# EasyEDA Pro project Core board.eprj

# Schematic Schematic1
Board Name: Board1; Create Date: 2024-09-08; Page Name: P1; Project Name: TestProject (STM32); Schematic Name: Schematic1; Update Date: 2024-12-12; Company: 嘉立创EDA; Page Size: A4; Version: V1.0
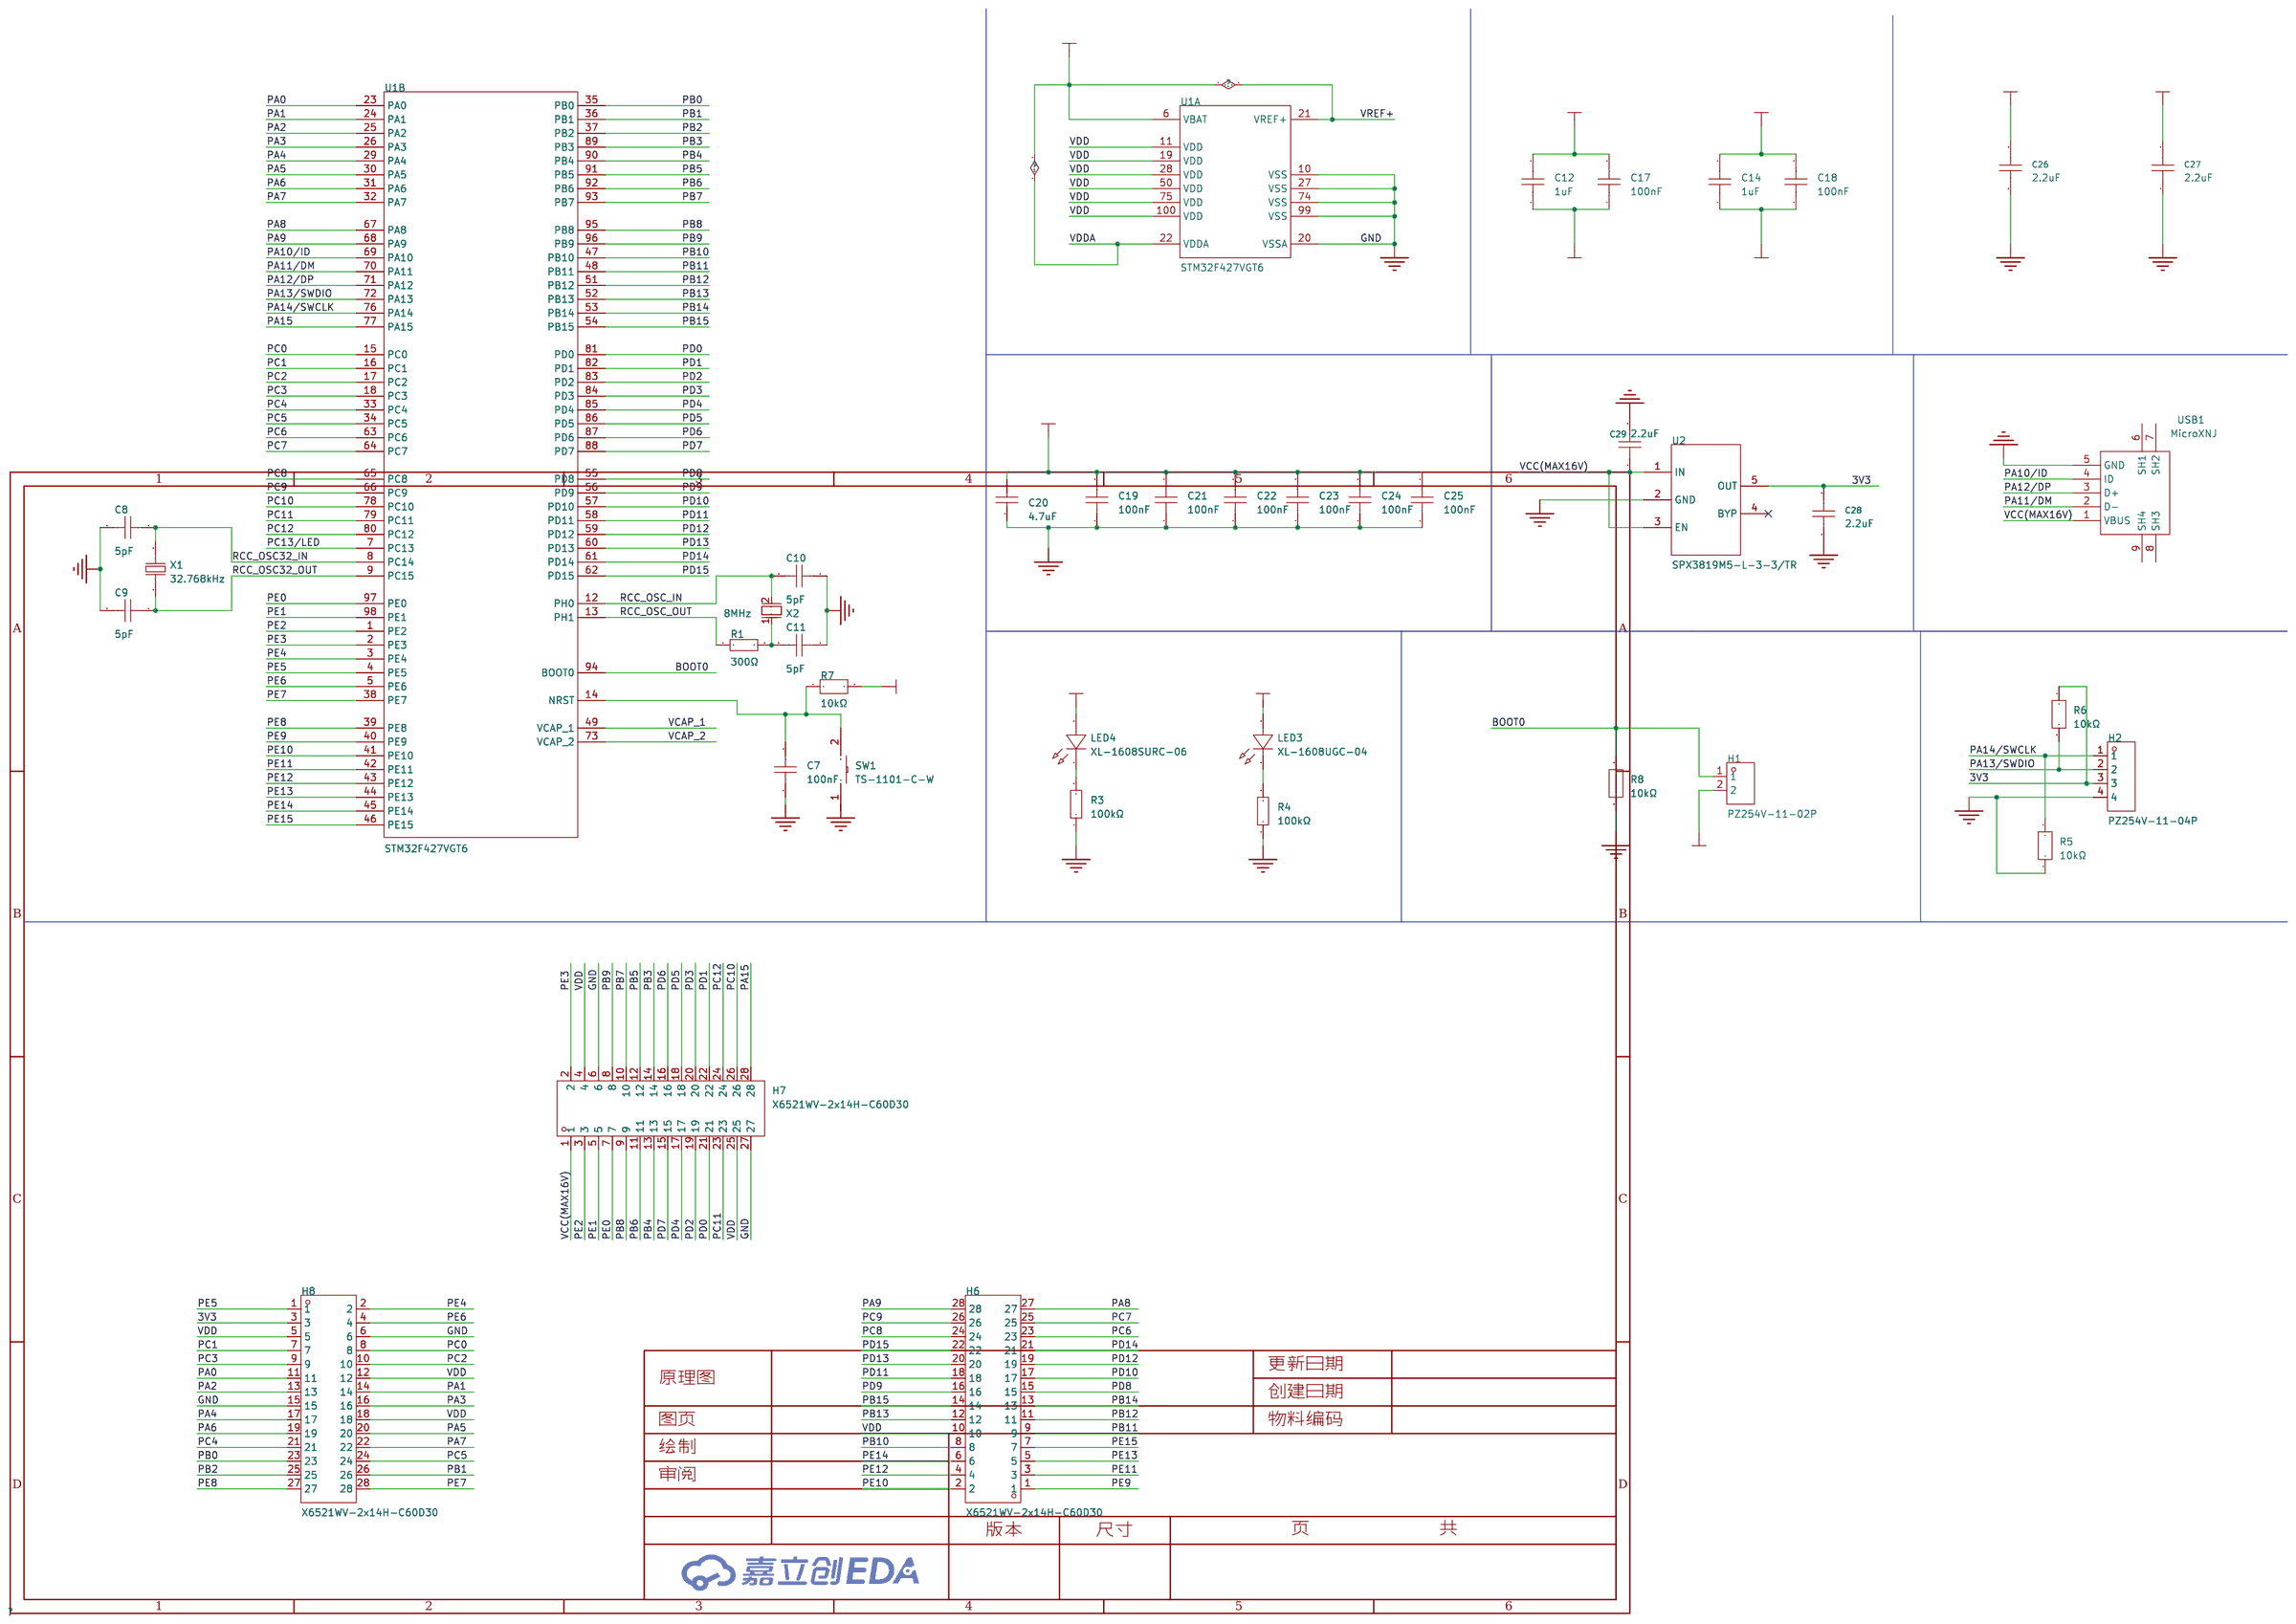
[diagram p0: schematic sheet]

## Parts
C7  100nF  [C0603]
C8  5pF  [C0603]
C9  5pF  [C0603]
C10  5pF  [C0603]
C11  5pF  [C0603]
C12  1uF  [C0603]
C14  1uF  [C0603]
C17  100nF  [C0603]
C18  100nF  [C0603]
C19  100nF  [C0603]
C20  4.7uF  [C0603]
C21  100nF  [C0603]
C22  100nF  [C0603]
C23  100nF  [C0603]
C24  100nF  [C0603]
C25  100nF  [C0603]
C26  2.2uF  [C0603]
C27  2.2uF  [C0603]
C28  2.2uF  [C0603]
C29  2.2uF  [C0603]
H1  PZ254V-11-02P  [HDR-TH_2P-P2.54-V-M]
H2  PZ254V-11-04P  [HDR-TH_4P-P2.54-V-M]
H6  X6521WV-2x14H-C60D30  [HDR-TH_28P-2.54-V-M-R2-C14-S2.54]
H7  X6521WV-2x14H-C60D30  [HDR-TH_28P-2.54-V-M-R2-C14-S2.54]
H8  X6521WV-2x14H-C60D30  [HDR-TH_28P-2.54-V-M-R2-C14-S2.54]
LED3  XL-1608UGC-04  [LED0603-RD_GREEN]
LED4  XL-1608SURC-06  [LED0603-RD_RED]
R1  300Ω  [R0603]
R3  100kΩ  [R0603]
R4  100kΩ  [R0603]
R5  10kΩ  [R0603]
R6  10kΩ  [R0603]
R7  10kΩ  [R0603]
R8  10kΩ  [R0603]
SW1  TS-1101-C-W  [SW-SMD_L6.0-W3.3-LS8.0]
U1  STM32F427VGT6  [LQFP-100_L14.0-W14.0-P0.50-LS16.0-BL]  (sections 1,2)
U2  SPX3819M5-L-3-3/TR  [SOT-23-5_L3.0-W1.7-P0.95-LS2.8-BL]
USB1  MicroXNJ  [MICRO-USB-SMD_MICROXNJ]
X1  32.768kHz  [FC-135R_L3.2-W1.5]
X2  8MHz  [OSC-SMD_2P-L3.2-W2.5]

## Library data of the parts
C7 C17-C19 C21-C25 = CGA0603X7R104K500JT: LCSC Part Name: 100nF ±10% 50V; Supplier Part: C6119867; Manufacturer: HRE(芯声); Supplier Footprint: 0603; Supplier: LCSC; Tolerance: ±10%; Voltage Rated: 50V; Temperature Coefficient: X7R
C8-C11 = CC0603CRNPO9BN5R0: LCSC Part Name: 5pF 50V; Supplier Part: C327203; Manufacturer: YAGEO(国巨); Supplier Footprint: 0603; Datasheet: https://atta.szlcsc.com/upload/public/pdf/source/20181031/C327203_3266E755B61C9DAA88589806E293F44D.pdf; Supplier: LCSC; Voltage Rated: 50V; Temperature Coefficient: NP0
C12 C14 = CL10A105KB8NNNC: LCSC Part Name: 1uF ±10% 50V; Supplier Part: C15849; Manufacturer: SAMSUNG(三星); Supplier Footprint: 0603; Datasheet: https://atta.szlcsc.com/upload/public/pdf/source/20160218/1457707763339.pdf; Supplier: LCSC; Tolerance: ±10%; Voltage Rated: 50V; Temperature Coefficient: X5R
C20 = CL10A475KO8NNNC: LCSC Part Name: 4.7uF ±10% 16V; Supplier Part: C19666; Manufacturer: SAMSUNG(三星); Supplier Footprint: 0603; Datasheet: https://atta.szlcsc.com/upload/public/pdf/source/20160218/1457707763339.pdf; Supplier: LCSC; Tolerance: ±10%; Voltage Rated: 16V; Temperature Coefficient: X5R
C26-C29 = CL10A225KB8NNNC: LCSC Part Name: 2.2uF ±10% 50V; Supplier Part: C913904; Manufacturer: SAMSUNG(三星); Supplier Footprint: 0603; Datasheet: https://atta.szlcsc.com/upload/public/pdf/source/20160218/1457707763339.pdf; Supplier: LCSC; Tolerance: ±10%; Voltage Rated: 50V; Temperature Coefficient: X5R
H1 = PZ254V-11-02P: LCSC Part Name: 间距:2.54mm 1x2P 直插 方针; Supplier Part: C492401; Manufacturer: XFCN(兴飞); Supplier Footprint: 插件,P=2.54mm; Datasheet: https://atta.szlcsc.com/upload/public/pdf/source/20200309/C492401_A812433581A9B211A7FFA413ADDFF0E5.pdf; Supplier: LCSC; Pin Structure: 1x2P; Pitch: 2.54mm; Circluar Pins/Square Pins: 方针; Mounting Type: 直插; Number of Rows: 单排; Number of Pins: 2P; Length of Mating Pin: 6mm; Insulation Height: 2.5mm; Length of End Connection Pin: 3mm; Contact Material: 黄铜; Operating Temperature Range: -40℃~+105℃; Color: 黑色
H2 = PZ254V-11-04P: LCSC Part Name: 间距:2.54mm 1x4P 直插 方针; Supplier Part: C2691448; Manufacturer: XFCN(兴飞); Supplier Footprint: 插件,P=2.54mm; Datasheet: https://atta.szlcsc.com/upload/public/pdf/source/20200309/C492403_F9F19131791D08044AD4F84F8E751A34.pdf; Supplier: LCSC; Pin Structure: 1x4P; Pitch: 2.54mm; Circluar Pins/Square Pins: 方针; Mounting Type: 直插; Number of Rows: 单排; Number of Pins: 4P; Current Rating (Max): 3A; Voltage Rating (Max): 250V; Length of Mating Pin: 6mm; Insulation Height: 2.5mm; Length of End Connection Pin: 3mm; Operating Temperature Range: -40℃~+105℃; Color: 黑色
H6-H8 = X6521WV-2x14H-C60D30: LCSC Part Name: 2x14P 间距:2.54mm 方针; Supplier Part: C725886; Manufacturer: XKB Connection(中国星坤); Supplier Footprint: 插件,P=2.54mm; Datasheet: https://atta.szlcsc.com/upload/public/pdf/source/20211009/DE33EBA4104B5B447A7BD8383FBBA145.pdf; Supplier: LCSC; Pin Structure: 2x14P; Pitch: 2.54mm; Row Spacing: 2.54mm; Circluar Pins/Square Pins: 方针; Number of Rows: 双排; Number of Pins: 28P; Current Rating (Max): 3A; Voltage Rating (Max): 250V; Insulation Height: 2.5mm; Contact Material: 黄铜; Contact Plating: 金; Operating Temperature Range: -40℃~+105℃; Soldering Temperature(Max): 260℃; Color: 黑色
LED3 = XL-1608UGC-04: Supplier Part: C965804; Manufacturer: XINGLIGHT(成兴光); Supplier Footprint: 0603; Datasheet: https://atta.szlcsc.com/upload/public/pdf/source/20221102/520D6E465E5CFD1609C8A4DBC80D4018.pdf; Supplier: LCSC; Emitted Color: 翠绿色; Power Dissipation: 80mW; Forward Current: 25mA; Dominant Wavelength: 516nm~525nm; Peak Wavelength: 534nm; Diode Configuration: 独立二极管; Lens Color: 无色透明透镜; Viewing Angle: 120°; Mounting Sytle: 正贴; Operating Temperature: -30℃~+85℃
LED4 = XL-1608SURC-06: Supplier Part: C965799; Manufacturer: XINGLIGHT(成兴光); Supplier Footprint: 0603; Datasheet: https://atta.szlcsc.com/upload/public/pdf/source/20221102/D860AFDD1CDB02C5A8064103A32707E2.pdf; Supplier: LCSC; Emitted Color: 红色; Power Dissipation: 55mW; Forward Current: 25mA; Dominant Wavelength: 617nm~621nm; Peak Wavelength: 623nm; Lens Color: 无色透明透镜; Viewing Angle: 120°; Mounting Sytle: 正贴; Operating Temperature: -30℃~+85℃
R1 = 0603WAF3000T5E: LCSC Part Name: 300Ω ±1% 100mW 厚膜电阻; Supplier Part: C23025; Manufacturer: UNI-ROYAL(厚声); Supplier Footprint: 0603; Datasheet: https://atta.szlcsc.com/upload/public/pdf/source/20200306/C422600_1E6D84923E4A46A82E41ADD87F860B5C.pdf; Supplier: LCSC; Type: 厚膜电阻; Tolerance: ±1%; Power(Watts): 100mW; Overload Voltage (Max): 75V; Temperature Coefficient: ±100ppm/℃; Operating Temperature Range: -55℃~+155℃
R3 R4 = RC0603FR-07100KL: LCSC Part Name: 厚膜电阻 100kΩ ±1% 100mW; Supplier Part: C14675; Manufacturer: YAGEO(国巨); Supplier Footprint: 0603; Datasheet: https://atta.szlcsc.com/upload/public/pdf/source/20140324/1457707028752.pdf; Supplier: LCSC; Type: 厚膜电阻; Tolerance: ±1%; Power(Watts): 100mW; Overload Voltage (Max): 75V; Temperature Coefficient: ±100ppm/℃; Operating Temperature Range: -55℃~+155℃
R5-R8 = FRC0603J103TS: LCSC Part Name: 10kΩ ±5% 100mW 厚膜电阻; Supplier Part: C2930027; Manufacturer: FOJAN(富捷); Supplier Footprint: 0603; Datasheet: https://atta.szlcsc.com/upload/public/pdf/source/20211221/925EC7D7225764EE0046F22065062C87.pdf; Supplier: LCSC; Type: 厚膜电阻; Tolerance: ±5%; Power(Watts): 100mW; Overload Voltage (Max): 75V; Temperature Coefficient: ±100ppm/℃; Operating Temperature Range: -55℃~+155℃
SW1 = TS-1101-C-W: LCSC Part Name: 6*3.6*2.5mm 立贴 轻触开关; Supplier Part: C318938; Manufacturer: XKB Connectivity(中国星坤); Supplier Footprint: SMD; Datasheet: https://atta.szlcsc.com/upload/public/pdf/source/20200227/C318938_C2E53B1EEDE37D980A33616AC086DE53.pdf; Supplier: LCSC; Circuit: 单刀单掷; Actuator Style: 矩形按钮; Operating Force: 260gf; Mounting Style: 立贴; Switch Length: 6mm; Switch Width: 3.6mm; Switch Height: 2.5mm; Strike Gundam: 不带; Contact Current: 50mA; Voltage Rating (DC): 12V; Actuator/Cap Color: 白色带淡绿; With Lamp: 无; Mechanical Life: 5万次; Operating Temperature: -30℃~+85℃
U1 = STM32F427VGT6: LCSC Part Name: 带DSP和FPU的高性能高级系列ARM Cortex-M4 MCU，具有1 MB Flash、180 MHz CPU、ART加速器、Chrom-ART加速器和FSMC; Supplier Part: C117815; Manufacturer: ST(意法半导体); Supplier Footprint: LQFP-100(14x14); Datasheet: https://atta.szlcsc.com/upload/public/pdf/source/20171120/C75389_15111748895051131877.pdf; Supplier: LCSC; CPU Core: ARM-M4; Program Storage Size: 1MB; RAM Size: 256KB; GPIO Ports Number: 82; Operating Voltage Range: 1.8V~3.6V; CPU Maximum Speed: 180MHz; Program Memory Type: FLASH; Operating Temperature Range: -40℃~+85℃; ADC (Bit): 12bit; DAC (Bit): 12bit; Universal Serial Bus: 有; Peripheral/Function: PWM；PWM; Watchdog: 有; Infrared Data Association: 有; Low-Voltage Detect: 有; Direct Memory Access: 有; Internal Oscillator: 有
U2 = SPX3819M5-L-3-3/TR: LCSC Part Name: 输入16V 输出3.3V 500mA; Supplier Part: C9055; Manufacturer: MaxLinear(迈凌); Supplier Footprint: SOT-23-5; Datasheet: https://atta.szlcsc.com/upload/public/pdf/source/20150720/1457707331934.pdf; Supplier: LCSC; Output Type: 固定; Maximum Input Voltage: 16V; Output Voltage: 3.3V; MAX Output Current: 500mA; Power Supply Rejection Ratio (PSRR): 70dB; Dropout Voltage: 700mV@(500mA); standby current: 8uA; Operating Temperature: -40℃~+125℃; Output Polarity: 正极; Number of Outputs: 1
USB1 = MicroXNJ: LCSC Part Name: Micro-B 母 卧贴; Supplier Part: C404969; Manufacturer: SHOU HAN(首韩); Supplier Footprint: SMD; Datasheet: https://atta.szlcsc.com/upload/public/pdf/source/20220415/2494EDFF499AF6F852F7C820374B6AF3.pdf; Supplier: LCSC; Connector Type: Micro-B; Standard: USB 2.0; Gender: 母; Mounting Style: 卧贴; Number of Contacts: 5P; Number of Ports: 1; Current Rating - Power (Max): 1A; Operating Temperature Range: -20℃~+85℃
X1 = Q13FC13500004_C32346: LCSC Part Name: 32.768kHz ±20ppm 12.5pF; Supplier Part: C32346; Manufacturer: EPSON(爱普生); Manufacturer Part: Q13FC13500004; Supplier Footprint: SMD3215-2P; Datasheet: https://atta.szlcsc.com/upload/public/pdf/source/20240418/0E0FF5F0356BA3753F616001439D1416.pdf; Supplier: LCSC; Crystal Type: 贴片晶振; Normal temperature Frequency Tolerance: ±20ppm; External load capacitor: 12.5pF; Equivalent Series Resistance (ESR): 70kΩ; Operating Temperature: -40℃~+85℃
X2 = A308000003: LCSC Part Name: FL:8M CL:12.0 FT:30 OP:-40TO~125 ST:100 CI:300 DL:10(100Max); Supplier Part: C409345; Manufacturer: TXC(晶技); Supplier Footprint: SMD3225; Datasheet: https://atta.szlcsc.com/upload/public/pdf/source/20240312/351197091BF4DB9A6E687BFC8ED82776.pdf; Supplier: LCSC; Crystal Type: 贴片晶振; Normal temperature Frequency Tolerance: ±30ppm; External load capacitor: 12pF; Equivalent Series Resistance (ESR): 300Ω; Operating Temperature: -40℃~+125℃

## Nets
3V3: C12.2 C14.2 C17.2 C18.2 C28.2 H1.2 H2.3 H8.3 LED4.2(A) R6.1 R7.2 U1.6(VBAT) U1.21(VREF+) U1.22(VDDA) U2.5(OUT)
GND: C7.1 C8.2 C9.2 C10.1 C11.1 C12.1 C14.1 C17.1 C18.1 C19.1 C20.1 C21.1 C22.1 C23.1 C24.1 C25.1 C26.1 C27.1 C28.1 C29.2 H2.4 H7.6 H7.27 H8.6 H8.15 R3.1 R4.1 R5.2 R8.1 SW1.1 U1.10(VSS) U1.20(VSSA) U1.27(VSS) U1.74(VSS) U1.99(VSS) U2.2(GND) USB1.5(GND)
VCC(MAX16V): C29.1 H7.1 U2.1(IN) U2.3(EN) USB1.1(VBUS)
VDD: C19.2 C20.2 C21.2 C22.2 C23.2 C24.2 C25.2 H6.10 H7.4 H7.25 H8.5 H8.12 H8.18 U1.11(VDD) U1.19(VDD) U1.28(VDD) U1.50(VDD) U1.75(VDD) U1.100(VDD)
BOOT0: H1.1 R8.2 U1.94(BOOT0)
PA0: H8.11 U1.23(PA0)
PA1: H8.14 U1.24(PA1)
PA2: H8.13 U1.25(PA2)
PA3: H8.16 U1.26(PA3)
PA4: H8.17 U1.29(PA4)
PA5: H8.20 U1.30(PA5)
PA6: H8.19 U1.31(PA6)
PA7: H8.22 U1.32(PA7)
PA8: H6.27 U1.67(PA8)
PA9: H6.28 U1.68(PA9)
PA10/ID: U1.69(PA10) USB1.4(ID)
PA11/DM: U1.70(PA11) USB1.2(D-)
PA12/DP: U1.71(PA12) USB1.3(D+)
PA13/SWDIO: H2.2 R6.2 U1.72(PA13)
PA14/SWCLK: H2.1 R5.1 U1.76(PA14)
PA15: H7.28 U1.77(PA15)
PB0: H8.23 U1.35(PB0)
PB1: H8.26 U1.36(PB1)
PB2: H8.25 U1.37(PB2)
PB3: H7.14 U1.89(PB3)
PB4: H7.13 U1.90(PB4)
PB5: H7.12 U1.91(PB5)
PB6: H7.11 U1.92(PB6)
PB7: H7.10 U1.93(PB7)
PB8: H7.9 U1.95(PB8)
PB9: H7.8 U1.96(PB9)
PB10: H6.8 U1.47(PB10)
PB11: H6.9 U1.48(PB11)
PB12: H6.11 U1.51(PB12)
PB13: H6.12 U1.52(PB13)
PB14: H6.13 U1.53(PB14)
PB15: H6.14 U1.54(PB15)
PC0: H8.8 U1.15(PC0)
PC1: H8.7 U1.16(PC1)
PC2: H8.10 U1.17(PC2)
PC3: H8.9 U1.18(PC3)
PC4: H8.21 U1.33(PC4)
PC5: H8.24 U1.34(PC5)
PC6: H6.23 U1.63(PC6)
PC7: H6.25 U1.64(PC7)
PC8: H6.24 U1.65(PC8)
PC9: H6.26 U1.66(PC9)
PC10: H7.26 U1.78(PC10)
PC11: H7.23 U1.79(PC11)
PC12: H7.24 U1.80(PC12)
PC13/LED: LED3.2(A) U1.7(PC13)
PD0: H7.21 U1.81(PD0)
PD1: H7.22 U1.82(PD1)
PD2: H7.19 U1.83(PD2)
PD3: H7.20 U1.84(PD3)
PD4: H7.17 U1.85(PD4)
PD5: H7.18 U1.86(PD5)
PD6: H7.16 U1.87(PD6)
PD7: H7.15 U1.88(PD7)
PD8: H6.15 U1.55(PD8)
PD9: H6.16 U1.56(PD9)
PD10: H6.17 U1.57(PD10)
PD11: H6.18 U1.58(PD11)
PD12: H6.19 U1.59(PD12)
PD13: H6.20 U1.60(PD13)
PD14: H6.21 U1.61(PD14)
PD15: H6.22 U1.62(PD15)
PE0: H7.7 U1.97(PE0)
PE1: H7.5 U1.98(PE1)
PE2: H7.3 U1.1(PE2)
PE3: H7.2 U1.2(PE3)
PE4: H8.2 U1.3(PE4)
PE5: H8.1 U1.4(PE5)
PE6: H8.4 U1.5(PE6)
PE7: H8.28 U1.38(PE7)
PE8: H8.27 U1.39(PE8)
PE9: H6.1 U1.40(PE9)
PE10: H6.2 U1.41(PE10)
PE11: H6.3 U1.42(PE11)
PE12: H6.4 U1.43(PE12)
PE13: H6.5 U1.44(PE13)
PE14: H6.6 U1.45(PE14)
PE15: H6.7 U1.46(PE15)
RCC_OSC32_IN: C8.1 U1.8(PC14) X1.2
RCC_OSC32_OUT: C9.1 U1.9(PC15) X1.1
RCC_OSC_IN: C10.2 U1.12(PH0) X2.2
RCC_OSC_OUT: R1.1 U1.13(PH1)
VCAP_1: C26.2 U1.49(VCAP_1)
VCAP_2: C27.2 U1.73(VCAP_2)
$1N5470: C11.2 R1.2 X2.1
$1N9196: LED3.1(K) R4.2
$1N16168: LED4.1(K) R3.2
$1N18836: C7.2 R7.1 SW1.2 U1.14(NRST)

Not connected (* = marked no-connect by the designer): U2 4(BYP)*; USB1 6(SH1) 7(SH2) 8(SH3) 9(SH4)

# Board PCB1
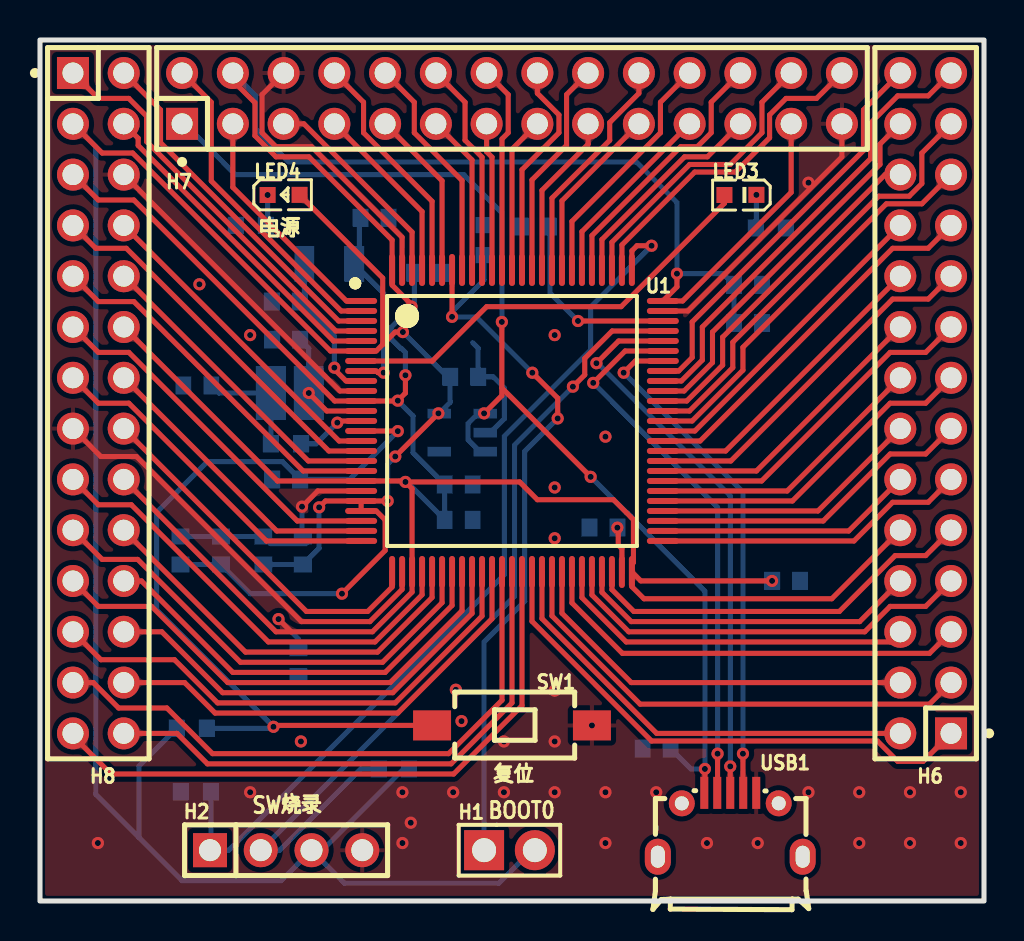
[diagram p1: board, top side]
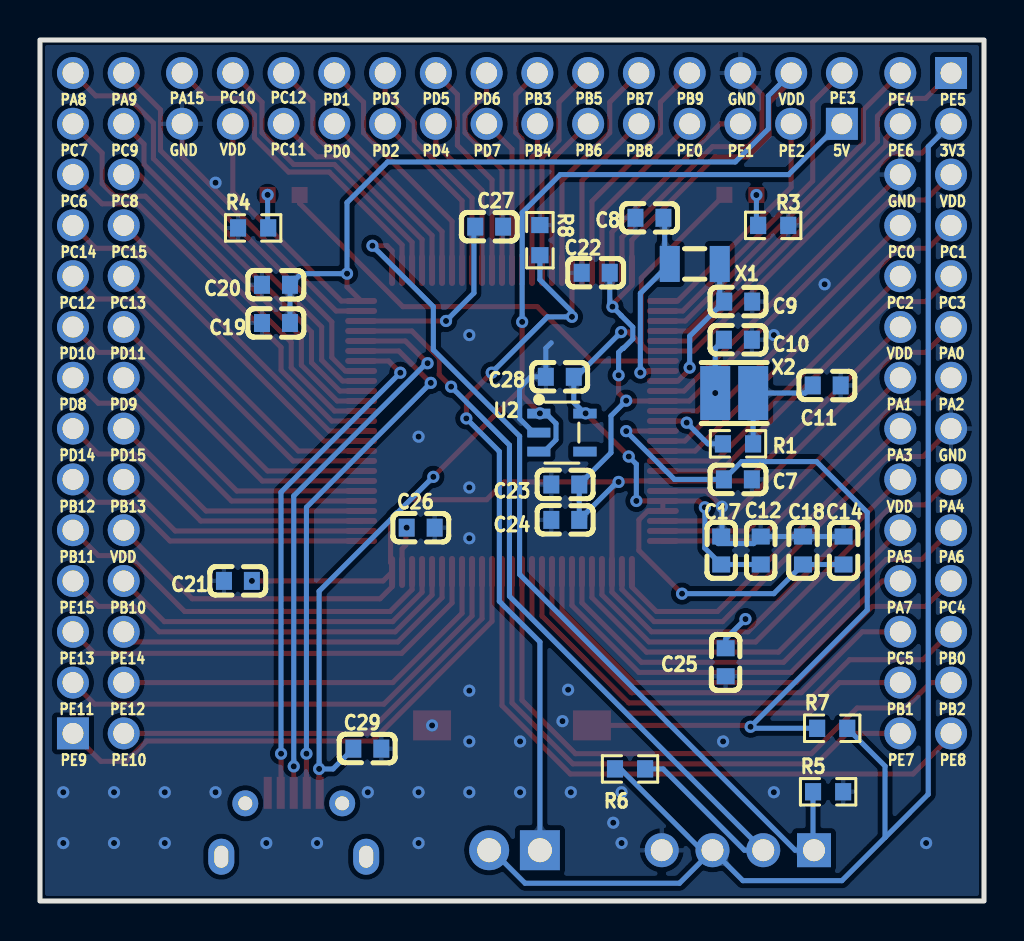
[diagram p2: board, bottom side, seen from below]

Outline 47.24 x 43.05 mm; copper layers: Top Layer, Bottom Layer. Coordinates in mm from the lower left corner of the outline.
Outline path: rectangle 0,43.05 47.24,0
Stack: Top Layer 0.035mm / Dielectric1 1.51mm FR4 er 4.5 / Bottom Layer 0.035mm

## Design rules (mm)
template: JLCPCB Capability(Two Layers Board)
spacing copperThickness1oz (default): track to track 0.102, other pairs 0.152 to 0.3
spacing copperThickness2oz: track to track 0.203, other pairs 0.152 to 0.3
track width copperThickness1oz (default): min 0.127, default 0.254, max 2.54
track width copperThickness2oz: min 0.203, default 0.254, max 2.54
differential pair differentialPair (default): width min 0.127, default 0.254, max 2.54; gap min 0.152, default 0.152
via viaSize (default): diameter min 0.5, default 0.61, max 10; hole min 0.3, default 0.305, max 6.3

## Placement (name value [footprint] x y rotation side)
C7  100nF  [C0603]  12.32 21.08 0 bottom
C8  5pF  [C0603]  16.75 34.16 0 bottom
C9  5pF  [C0603]  12.3 29.97 180 bottom
C10  5pF  [C0603]  12.32 28.07 0 bottom
C11  5pF  [C0603]  7.87 25.78 0 bottom
C12  1uF  [C0603]  11.18 17.53 270 bottom
C14  1uF  [C0603]  7.03 17.53 270 bottom
C17  100nF  [C0603]  13.15 17.53 270 bottom
C18  100nF  [C0603]  9.06 17.53 270 bottom
C19  100nF  [C0603]  35.43 28.9 180 bottom
C20  4.7uF  [C0603]  35.43 30.81 180 bottom
C21  100nF  [C0603]  37.34 16.01 180 bottom
C22  100nF  [C0603]  19.43 31.41 180 bottom
C23  100nF  [C0603]  20.95 20.83 180 bottom
C24  100nF  [C0603]  20.95 19.06 180 bottom
C25  100nF  [C0603]  12.93 11.94 90 bottom
C26  2.2uF  [C0603]  28.19 18.67 0 bottom
C27  2.2uF  [C0603]  24.77 33.72 0 bottom
C28  2.2uF  [C0603]  21.23 26.21 180 bottom
C29  2.2uF  [C0603]  30.86 7.62 180 bottom
H1  PZ254V-11-02P  [HDR-TH_2P-P2.54-V-M]  23.5 2.54 0 top
H2  PZ254V-11-04P  [HDR-TH_4P-P2.54-V-M]  12.32 2.54 0 top
H6  X6521WV-2x14H-C60D30  [HDR-TH_28P-2.54-V-M-R2-C14-S2.54]  44.32 24.89 90 top
H7  X6521WV-2x14H-C60D30  [HDR-TH_28P-2.54-V-M-R2-C14-S2.54]  23.62 40.13 0 top
H8  X6521WV-2x14H-C60D30  [HDR-TH_28P-2.54-V-M-R2-C14-S2.54]  2.92 24.89 270 top
LED3  XL-1608UGC-04  [LED0603-RD_GREEN]  35.05 35.31 180 top
LED4  XL-1608SURC-06  [LED0603-RD_RED]  12.19 35.31 0 top
R1  300Ω  [R0603]  12.31 22.86 180 bottom
R3  100kΩ  [R0603]  10.55 33.78 0 bottom
R4  100kΩ  [R0603]  36.58 33.66 180 bottom
R5  10kΩ  [R0603]  7.8 5.46 180 bottom
R6  10kΩ  [R0603]  17.71 6.6 180 bottom
R7  10kΩ  [R0603]  7.6 8.64 180 bottom
R8  10kΩ  [R0603]  22.23 33.05 270 bottom
SW1  TS-1101-C-W  [SW-SMD_L6.0-W3.3-LS8.0]  23.62 8.78 180 top
U1  STM32F427VGT6  [LQFP-100_L14.0-W14.0-P0.50-LS16.0-BL]  23.62 24 270 top
U2  SPX3819M5-L-3-3/TR  [SOT-23-5_L3.0-W1.7-P0.95-LS2.8-BL]  21.13 23.42 270 bottom
USB1  MicroXNJ  [MICRO-USB-SMD_MICROXNJ]  34.54 3.81 0 top
X1  32.768kHz  [FC-135R_L3.2-W1.5]  14.48 31.86 0 bottom
X2  8MHz  [OSC-SMD_2P-L3.2-W2.5]  12.5 25.4 180 bottom

## Footprints (pads in the part's own frame, mm; a bottom-side part is the same pattern mirrored in y, then rotated)
C0603
  rect 0.8x0.9 smd: 1(-0.7,0) 2(0.7,0)
FC-135R_L3.2-W1.5
  rect 1x1.8 smd: 1(-1.25,0) 2(1.25,0)
HDR-TH_2P-P2.54-V-M
  rect 2x2 hole 1.2: 1(-1.27,0)
  round 2 hole 1.2: 2(1.27,0)
HDR-TH_4P-P2.54-V-M
  rect 1.7x1.7 hole 1.1: 1(-3.81,0)
  round 1.7 hole 1.1: 2(-1.27,0) 3(1.27,0) 4(3.81,0)
HDR-TH_28P-2.54-V-M-R2-C14-S2.54
  rect 1.6x1.6 hole 1.05: 1(-16.51,-1.27)
  round 1.6 hole 1.05: 2(-16.51,1.27) 3(-13.97,-1.27) 4(-13.97,1.27) 5(-11.43,-1.27) 6(-11.43,1.27) 7(-8.89,-1.27) 8(-8.89,1.27) 9(-6.35,-1.27) 10(-6.35,1.27) 11(-3.81,-1.27) 12(-3.81,1.27) 13(-1.27,-1.27) 14(-1.27,1.27) 15(1.27,-1.27) 16(1.27,1.27) 17(3.81,-1.27) 18(3.81,1.27) 19(6.35,-1.27) 20(6.35,1.27) 21(8.89,-1.27) 22(8.89,1.27) 23(11.43,-1.27) 24(11.43,1.27) 25(13.97,-1.27) 26(13.97,1.27) 27(16.51,-1.27) 28(16.51,1.27)
LED0603-RD_GREEN
  rect 0.8x0.8 smd: 1(-0.799,-0.004) 2(0.799,0.004)
LED0603-RD_RED
  rect 0.8x0.8 smd: 1(-0.799,-0.004) 2(0.799,0.004)
LQFP-100_L14.0-W14.0-P0.50-LS16.0-BL
  oval 0.3x1.6 smd: 1(-6,-7.55) 2(-5.5,-7.55) 3(-5,-7.55) 4(-4.5,-7.55) 5(-4,-7.55) 6(-3.5,-7.55) 7(-3,-7.55) 8(-2.5,-7.55) 9(-2,-7.55) 10(-1.5,-7.55) 11(-1,-7.55) 12(-0.5,-7.55) 13(0,-7.55) 14(0.5,-7.55) 15(1,-7.55) 16(1.5,-7.55) 17(2,-7.55) 18(2.5,-7.55) 19(3,-7.55) 20(3.5,-7.55) 21(4,-7.55) 22(4.5,-7.55) 23(5,-7.55) 24(5.5,-7.55) 25(6,-7.55) 51(6,7.55) 52(5.5,7.55) 53(5,7.55) 54(4.5,7.55) 55(4,7.55) 56(3.5,7.55) 57(3,7.55) 58(2.5,7.55) 59(2,7.55) 60(1.5,7.55) 61(1,7.55) 62(0.5,7.55) 63(0,7.55) 64(-0.5,7.55) 65(-1,7.55) 66(-1.5,7.55) 67(-2,7.55) 68(-2.5,7.55) 69(-3,7.55) 70(-3.5,7.55) 71(-4,7.55) 72(-4.5,7.55) 73(-5,7.55) 74(-5.5,7.55) 75(-6,7.55)
  oval 1.6x0.3 smd: 26(7.55,-6) 27(7.55,-5.5) 28(7.55,-5) 29(7.55,-4.5) 30(7.55,-4) 31(7.55,-3.5) 32(7.55,-3) 33(7.55,-2.5) 34(7.55,-2) 35(7.55,-1.5) 36(7.55,-1) 37(7.55,-0.5) 38(7.55,0) 39(7.55,0.5) 40(7.55,1) 41(7.55,1.5) 42(7.55,2) 43(7.55,2.5) 44(7.55,3) 45(7.55,3.5) 46(7.55,4) 47(7.55,4.5) 48(7.55,5) 49(7.55,5.5) 50(7.55,6) 76(-7.55,6) 77(-7.55,5.5) 78(-7.55,5) 79(-7.55,4.5) 80(-7.55,4) 81(-7.55,3.5) 82(-7.55,3) 83(-7.55,2.5) 84(-7.55,2) 85(-7.55,1.5) 86(-7.55,1) 87(-7.55,0.5) 88(-7.55,0) 89(-7.55,-0.5) 90(-7.55,-1) 91(-7.55,-1.5) 92(-7.55,-2) 93(-7.55,-2.5) 94(-7.55,-3) 95(-7.55,-3.5) 96(-7.55,-4) 97(-7.55,-4.5) 98(-7.55,-5) 99(-7.55,-5.5) 100(-7.55,-6)
MICRO-USB-SMD_MICROXNJ
  rect 0.4x1.6 smd: 1(-1.3,1.597) 2(-0.65,1.597) 3(0,1.597) 4(0.65,1.597) 5(1.3,1.597)
  round 1.3 hole 0.7: 6(2.425,1.074) 9(-2.425,1.073)
  oval 1.3x1.8 hole 0.7x1.1: 7(3.625,-1.597) 8(-3.625,-1.597)
OSC-SMD_2P-L3.2-W2.5
  rect 1.5x2.7 smd: 1(0.95,0) 2(-0.95,0)
R0603
  rect 0.806x0.864 smd: 1(-0.753,0) 2(0.753,0)
SOT-23-5_L3.0-W1.7-P0.95-LS2.8-BL
  rect 0.49x1.157 smd: 1(-0.95,-1.153) 2(0,-1.153) 3(0.95,-1.153)
  rect 0.49x1.175 smd: 4(0.95,1.153) 5(-0.95,1.153)
SW-SMD_L6.0-W3.3-LS8.0
  rect 1.9x1.5 smd: 1(-4,0) 2(4,0)

## Nets
As in the schematic.

Pads without a net: U2 4; USB1 6 7 8 9

## Via types
v1: diameter 0.61, hole 0.305, Top Layer to Bottom Layer, 73 vias

## Routing (per net, layer and track width the routed paths; a pad name or vN(x,y) marks a point on that pad's centre or on a via; arc(x,y) is an arc through that point)
3V3: length 138.1
  Top Layer w0.254: v1(18.16,28.45) 17.77,28.45 17.15,27.83 ; U1.21 v1(17.4,20) ; U1.21 14.29,20 v1(13.97,19.69) ; U1.21 U1.22 16.83,19.5 17.27,19.06 17.27,17.53 v1(15.11,15.37) ; 17.15,27.83 17.15,31.15 LED4.2 ; 17.15,27.83 16.83,27.5 U1.6 14.54,27.5 4.64,37.4 3.11,37.4 H8.3 ; v1(17.78,22.23) v1(19.94,24.38)
  Bottom Layer w0.254: 4.95,3.18 2.79,5.33 2.79,37.72 H8.3 ; 4.95,3.18 7.11,1.02 12.07,1.02 H2.3 ; 4.95,3.18 4.95,6.74 R7.2 ; C12.2 C17.2 13.97,17.64 v1(13.97,19.69) ; C14.2 C18.2 10.52,15.37 v1(15.11,15.37) ; R6.1 18.19,6.6 14.13,2.54 H2.3 ; H2.3 15.24,0.89 22.97,0.89 24.62,2.54 H1.2 ; v1(17.78,22.23) 17.4,21.84 v1(17.4,20) ; U2.5 20.53,24.93 C28.2 20.4,26.21 v1(18.16,28.45)
GND: length 83.8
  Top Layer w0.254: U1.27 18.12,15.58 16.51,13.97 13.08,13.97 4.83,22.23 3.05,22.23 H8.15 ; U1.20 13.9,20.5 v1(13.11,19.72) ; H8.6 15.01,25.5 U1.10 ; H7.6 11.11,40.32 11.11,38.42 11.81,37.72 13.59,37.72 18.12,33.19 U1.99 ; H7.27 40.13,37.21 32.42,29.5 U1.74
  Bottom Layer w0.254: 21.66,27.92 21.93,27.64 C28.1 22.68,26.21 23.24,25.65 23.24,24.12 22.55,23.42 U2.2 ; C17.1 13.11,18.27 v1(13.11,19.72) ; C12.1 11.53,17.87 13.3,17.87 13.41,17.97 ; 11.05,18.23 C18.1 C14.1
  vias: v1(2.9,2.9) v1(7.98,30.84) v1(10.52,28.3) v1(10.52,5.44) v1(13.06,7.98) v1(18.14,5.44) v1(18.14,2.9) v1(18.56,3.91) v1(20.68,5.44) v1(20.81,10.56) v1(21.1,8.99) v1(23.22,7.98) v1(23.22,5.44) v1(25.76,28.3) v1(25.76,20.68) v1(25.76,18.14) v1(25.76,10.52) v1(25.76,7.98) v1(25.76,5.44) v1(27.62,8.78) v1(28.3,23.22) v1(28.3,5.44) v1(28.3,2.9) v1(30.84,5.44) v1(33.38,2.9) v1(35.92,2.9) v1(38.46,35.92) v1(38.46,5.44) v1(41,5.44) v1(41,2.9) v1(43.54,5.44) v1(43.54,2.9) v1(46.08,5.44) v1(46.08,2.9)
VCC(MAX16V): length 57.8
  Top Layer w0.254: v1(22.23,24.38) 23.11,25.27 23.11,25.65 ; 23.11,25.65 v1(27.56,21.21) ; 23.11,25.65 v1(23.11,28.96) ; v1(33.27,6.6) 33.27,5.44 USB1.1
  Bottom Layer w0.254: U2.1 21.92,24.37 21.42,23.87 21.42,23.06 22.01,22.47 U2.3 ; v1(23.11,28.96) 23.11,34.42 21.21,36.32 9.78,36.32 7.24,38.86 H7.1 ; v1(27.56,21.21) 29.37,19.4 29.41,19.4 29.57,19.23 29.57,19.2 33.27,15.49 v1(33.27,6.6) 32.58,6.6 C29.1
VDD: length 184.5
  Top Layer w0.254: v1(36.64,16.01) 30.07,16.01 U1.50 ; H6.10 39.62,15.11 30.23,15.11 29.62,15.72 U1.50 ; U1.50 29.62,16.85 29.7,16.93 29.7,19.07 28.7,20.07 24.89,20.07 24,20.95 v1(18.29,20.95) ; v1(18.29,20.95) 18.62,20.62 U1.28 18.62,15.45 16.64,13.46 12.57,13.46 ; v1(18.29,20.95) 18.24,21 U1.19 11.89,21 H8.12 ; v1(18.6,29.72) 18.6,29.82 17.62,30.8 U1.100 17.62,33.05 13.46,37.21 11.81,37.21 10.76,38.27 10.76,39.92 9.65,41.02 H7.4 ; 12.57,13.46 11.81,13.46 H8.18 ; 12.57,13.46 v1(11.94,14.1) ; H7.25 37.59,35.43 32.16,30 U1.75 31.88,30.71 v1(31.88,31.37) ; v1(18.29,26.29) 18.29,25.4 v1(17.91,25.02) 17.89,25 U1.11 14.75,25 4.7,35.05 2.92,35.05 H8.5
  Bottom Layer w0.254: v1(11.94,14.1) 12.93,13.11 C25.2 ; v1(18.29,20.95) 18.36,20.95 C24.2 C23.2 18.67,22.41 18.67,24.26 v1(17.91,25.02) ; H7.4 10.8,40.26 10.8,38.61 12.45,36.96 29.85,36.96 31.88,34.93 v1(31.88,31.37) 34.18,31.37 C20.2 C19.2 ; C22.2 18.73,29.85 v1(18.6,29.72) 18.16,29.28 18.16,29.27 17.58,28.69 17.58,28.11 18.05,27.64 18.08,27.64 18.29,27.43 v1(18.29,26.29)
BOOT0: length 37.2
  Top Layer w0.254: v1(25.91,24.13) 25.91,25.15 v1(24.64,26.42) ; U1.94 v1(20.62,29.21)
  Bottom Layer w0.254: v1(24.64,26.42) 21.84,29.21 v1(20.62,29.21) 20.62,29.46 22.23,31.07 R8.2 ; H1.1 22.23,12.95 24.26,14.99 24.26,22.48 v1(25.91,24.13)
PA0: length 18.4
  Top Layer w0.254: U1.23 12.88,19 4.45,27.43 2.92,27.43 H8.11
PA1: length 15.1
  Top Layer w0.254: U1.24 11.85,18.5 H8.14
PA2: length 17.8
  Top Layer w0.254: H8.13 2.92,24.89 4.45,24.89 11.34,18 U1.25
PA3: length 18.5
  Top Layer w0.254: H8.16 13.33,14.48 16.4,14.48 17.62,15.7 U1.26
PA4: length 23
  Top Layer w0.254: U1.29 19.12,15.31 16.76,12.95 11.43,12.95 4.57,19.81 2.92,19.81 H8.17
PA5: length 20.4
  Top Layer w0.254: U1.30 19.62,15.18 16.89,12.45 10.29,12.45 H8.20
PA6: length 24
  Top Layer w0.254: U1.31 20.12,14.92 17.14,11.94 10.03,11.94 4.89,17.08 3.11,17.08 H8.19
PA7: length 21.4
  Top Layer w0.254: H8.22 5.08,16 9.65,11.43 17.27,11.43 20.62,14.78 U1.32
PA8: length 22.8
  Top Layer w0.254: U1.67 32.1,26 33.15,27.05 33.15,28.7 41.57,37.12 41.57,38.9 42.92,40.26 44.45,40.26 H6.27
PA9: length 20.3
  Top Layer w0.254: U1.68 31.96,26.5 32.64,27.18 32.64,28.96 41.21,37.53 41.21,39.56 H6.28
PA10/ID: length 25.7
  Top Layer w0.254: U1.69 29.8,27 v1(29.21,26.42) ; v1(35.18,7.37) 35.18,5.42 USB1.4
  Bottom Layer w0.254: v1(35.18,7.37) 35.18,20.45 v1(29.21,26.42)
PA11/DM: length 27.2
  Top Layer w0.254: U1.70 29.29,27.5 27.69,25.91 v1(27.69,25.91) ; v1(33.91,7.37) 33.91,5.42 USB1.2
  Bottom Layer w0.254: v1(33.91,7.37) 33.91,19.69 v1(27.69,25.91)
PA12/DP: length 28.1
  Top Layer w0.254: v1(34.54,6.73) USB1.3 ; U1.71 28.96,28 v1(27.85,26.89)
  Bottom Layer w0.254: v1(27.85,26.89) 27.91,26.89 34.54,20.26 v1(34.54,6.73)
PA13/SWDIO: length 43.6
  Top Layer w0.254: v1(26.67,25.72) 27.26,26.31 27.26,27.13 28.63,28.5 U1.72
  Bottom Layer w0.254: v1(26.67,25.72) 23.75,22.8 23.75,15.24 H2.2 11.99,2.54 16.06,6.6 17.22,6.6
PA14/SWCLK: length 44.9
  Top Layer w0.254: U1.76 29.62,32.51 29.88,32.77 v1(30.61,32.77)
  Bottom Layer w0.254: 8.56,5.46 8.56,2.59 H2.1 9.45,2.54 23.24,16.33 23.24,23.24 27.56,27.56 27.56,29.72 v1(30.61,32.77)
PA15: length 16.5
  Top Layer w0.254: H7.28 38.86,40.13 37.34,40.13 36.51,39.31 36.51,38.16 34.8,36.45 32.77,36.45 29.12,32.81 U1.77
PB0: length 25.9
  Top Layer w0.254: H8.23 3.05,12.07 6.73,12.07 8.89,9.91 17.78,9.91 22.12,14.25 U1.35
PB1: length 23.4
  Top Layer w0.254: H8.26 7.24,10.92 8.76,9.4 17.91,9.4 22.62,14.11 U1.36
PB2: length 30.5
  Top Layer w0.254: H8.25 2.67,10.92 3.94,9.65 6.35,9.65 8.64,7.37 20.45,7.37 23.12,10.04 U1.37
PB3: length 10.4
  Top Layer w0.254: H7.14 23.43,40.32 23.43,38.42 23.12,38.11 U1.89
PB4: length 7.4
  Top Layer w0.254: U1.90 22.62,37.2 22.35,37.47 H7.13
PB5: length 10.8
  Top Layer w0.254: H7.12 21.27,39.94 21.27,38.04 22.12,37.19 U1.91
PB6: length 8.1
  Top Layer w0.254: U1.92 21.62,37.05 H7.11
PB7: length 11.4
  Top Layer w0.254: U1.93 21.12,36.03 18.73,38.42 18.73,39.94 H7.10
PB8: length 8.5
  Top Layer w0.254: H7.9 20.12,36.01 U1.95
PB9: length 11.9
  Top Layer w0.254: U1.96 19.62,34.99 16.19,38.42 16.19,39.94 H7.8
PB10: length 17.4
  Top Layer w0.254: H6.8 41.02,13.97 29.59,13.97 28.12,15.44 U1.47
PB11: length 20
  Top Layer w0.254: H6.9 44.32,17.27 42.8,17.27 40,14.48 29.72,14.48 28.62,15.57 U1.48
PB12: length 15.7
  Top Layer w0.254: H6.11 44.45,19.94 42.67,19.94 40.74,18 U1.51
PB13: length 12.9
  Top Layer w0.254: U1.52 40.47,18.5 H6.12
PB14: length 16.3
  Top Layer w0.254: H6.13 44.32,22.35 42.55,22.35 39.2,19 U1.53
PB15: length 13.6
  Top Layer w0.254: H6.14 38.93,19.5 U1.54
PC0: length 16.3
  Top Layer w0.254: U1.15 14.97,23 H8.8
PC1: length 19.1
  Top Layer w0.254: H8.7 2.79,32.64 4.32,32.64 14.46,22.5 U1.16
PC2: length 15.7
  Top Layer w0.254: U1.17 13.43,22 H8.10
PC3: length 18.5
  Top Layer w0.254: H8.9 2.92,29.97 4.7,29.97 13.17,21.5 U1.18
PC4: length 25
  Top Layer w0.254: H8.21 2.92,14.73 5.59,14.73 9.4,10.92 17.53,10.92 21.12,14.52 U1.33
PC5: length 22.4
  Top Layer w0.254: H8.24 6.1,13.46 9.14,10.41 17.65,10.41 21.62,14.38 U1.34
PC6: length 20.2
  Top Layer w0.254: U1.63 32.64,24 35.18,26.54 35.18,27.69 42.35,34.86 44.13,34.86 H6.23
PC7: length 22
  Top Layer w0.254: H6.25 44.13,37.4 44.13,35.88 43.5,35.24 41.97,35.24 34.67,27.94 34.67,26.67 32.5,24.5 U1.64
PC8: length 17.4
  Top Layer w0.254: U1.65 32.37,25 34.16,26.8 34.16,28.19 42.29,36.32 H6.24
PC9: length 18.9
  Top Layer w0.254: U1.66 32.23,25.5 33.66,26.92 33.66,28.45 42.04,36.83 42.04,37.85 H6.26
PC10: length 14.8
  Top Layer w0.254: H7.26 36.13,39.94 36.13,38.42 34.55,36.83 32.51,36.83 28.62,32.94 U1.78
PC11: length 10.8
  Top Layer w0.254: H7.23 33.4,37.21 32.26,37.21 28.12,33.08 U1.79
PC12: length 13.4
  Top Layer w0.254: U1.80 27.62,33.27 32.07,37.72 32.89,37.72 33.59,38.42 33.59,39.94 H7.24
PC13/LED: length 21.9
  Top Layer w0.254: LED3.2 34.25,34.89 29.08,29.72 22.35,29.72 19.64,27 U1.7
PD0: length 9.5
  Top Layer w0.254: H7.21 27.12,33.47 U1.81
PD1: length 12.3
  Top Layer w0.254: H7.22 31.05,39.94 31.05,38.42 26.62,33.99 U1.82
PD2: length 8.9
  Top Layer w0.254: U1.83 26.12,35.01 H7.19
PD3: length 11.7
  Top Layer w0.254: U1.84 25.62,35.15 28.51,38.04 28.51,38.93 29.97,40.39 H7.20
PD4: length 8.3
  Top Layer w0.254: H7.17 27.43,37.85 25.12,35.54 U1.85
PD5: length 11
  Top Layer w0.254: U1.86 24.62,36.06 26.35,37.79 26.35,40.32 H7.18
PD6: length 11.1
  Top Layer w0.254: U1.87 24.12,36.57 25.97,38.42 25.97,39.31 24.89,40.39 H7.16
PD7: length 7.8
  Top Layer w0.254: U1.88 23.62,37.59 H7.15
PD8: length 17
  Top Layer w0.254: H6.15 44.32,24.89 42.55,24.89 37.66,20 U1.55
PD9: length 14.2
  Top Layer w0.254: H6.16 37.39,20.5 U1.56
PD10: length 17.6
  Top Layer w0.254: U1.57 36.12,21 42.55,27.43 44.32,27.43 H6.17
PD11: length 14.9
  Top Layer w0.254: H6.18 35.85,21.5 U1.58
PD12: length 18.2
  Top Layer w0.254: U1.59 34.58,22 42.67,30.1 44.45,30.1 H6.19
PD13: length 15.5
  Top Layer w0.254: H6.20 34.31,22.5 U1.60
PD14: length 18.9
  Top Layer w0.254: U1.61 33.04,23 42.67,32.64 44.45,32.64 H6.21
PD15: length 16.1
  Top Layer w0.254: U1.62 32.77,23.5 H6.22
PE0: length 9.1
  Top Layer w0.254: H7.7 19.12,34.47 U1.97
PE1: length 10.6
  Top Layer w0.254: U1.98 18.62,33.45 13.21,38.86 H7.5
PE2: length 11.9
  Top Layer w0.254: H7.3 9.65,35.69 15.34,30 U1.1
PE3: length 16.2
  Top Layer w0.254: H7.2 8.57,39.94 8.57,36 15.07,29.5 U1.2
PE4: length 18
  Top Layer w0.254: H8.2 6.03,39.56 6.03,37.92 14.95,29 U1.3
PE5: length 20.5
  Top Layer w0.254: U1.4 14.8,28.5 5.33,37.97 5.33,39.25 4.45,40.13 2.92,40.13 H8.1
PE6: length 16.6
  Top Layer w0.254: U1.5 14.69,28 4.91,37.78 4.91,38.14 H8.4
PE7: length 27.9
  Top Layer w0.254: H8.28 6.86,8.38 8.38,6.86 20.57,6.86 23.62,9.91 U1.38
PE8: length 31.5
  Top Layer w0.254: U1.39 24.12,9.77 20.7,6.35 3.56,6.35 1.65,8.26 H8.27
PE9: length 26.9
  Top Layer w0.254: U1.40 24.62,13.99 30.61,8 41.91,8 42.92,6.98 44.2,6.98 H6.1
PE10: length 22.6
  Top Layer w0.254: U1.41 25.12,14.12 30.86,8.38 H6.2
PE11: length 24.4
  Top Layer w0.254: U1.42 25.62,14.26 30.04,9.84 44.51,9.84 H6.3
PE12: length 20.4
  Top Layer w0.254: H6.4 29.59,10.92 26.12,14.39 U1.43
PE13: length 22
  Top Layer w0.254: U1.44 26.62,14.91 29.15,12.38 44.51,12.38 H6.5
PE14: length 18.3
  Top Layer w0.254: H6.6 42.55,12.95 29.34,12.95 27.12,15.17 U1.45
PE15: length 20.9
  Top Layer w0.254: H6.7 44.32,14.73 42.55,14.73 41.27,13.46 29.46,13.46 27.62,15.3 U1.46
RCC_OSC32_IN: length 9.6
  Top Layer w0.254: v1(17.2,26.42) 16.91,26.42 16.83,26.5 U1.8
  Bottom Layer w0.254: C8.1 15.98,34.1 15.98,32.11 X1.2 17.2,30.39 v1(17.2,26.42)
RCC_OSC32_OUT: length 7.7
  Top Layer w0.254: v1(14.73,26.67) 14.73,26.59 15.32,26 U1.9
  Bottom Layer w0.254: v1(14.73,26.67) 14.73,28.24 C9.1 13.23,30.2 X1.1
RCC_OSC_IN: length 5.8
  Top Layer w0.254: v1(13.45,25.4) 14.35,24.5 U1.12
  Bottom Layer w0.254: C10.2 13.45,27.63 v1(13.45,25.4)
RCC_OSC_OUT: length 3.5
  Top Layer w0.254: v1(14.88,23.92) 14.96,24 U1.13
  Bottom Layer w0.254: R1.1 13.82,22.86 v1(14.88,23.92)
VCAP_1: length 2.3
  Top Layer w0.254: v1(28.89,18.67) 28.94,18.62 28.94,17.8 29.12,17.61 U1.49
VCAP_2: length 9.6
  Top Layer w0.254: v1(26.92,29) U1.73
  Bottom Layer w0.254: v1(26.92,29) 25.53,30.4 25.53,33.66 C27.2
$1N5470: length 5.7
  Bottom Layer w0.254: C11.2 8.95,25.4 X2.1 11.56,25.39 R1.2
$1N9196: length 1.7
  Bottom Layer w0.254: v1(35.85,35.31) 35.85,33.68 R4.2
$1N16168: length 1.6
  Bottom Layer w0.254: v1(11.39,35.3) 11.39,33.87 R3.2
$1N18836: length 40.8
  Top Layer w0.254: v1(17.91,23.5) 17.9,23.5 U1.14 ; SW1.2 11.75,8.78 v1(11.68,8.71)
  Bottom Layer w0.254: R7.1 11.61,8.64 v1(11.68,8.71) 5.84,14.55 5.84,19.43 8.38,21.97 12.13,21.97 C7.2 15.49,21.08 v1(17.91,23.5)

## Copper pours and planes (outline as drawn; the poured copper is in the pictures)
GND on Top Layer: 0,43.05 47.24,43.05 47.24,0 0,0
GND on Bottom Layer: 0,43.05 47.24,43.05 47.24,0 0,0
GND on Bottom Layer: 0.13,42.93 47.37,42.93 47.37,-0.13 0.13,-0.13

Small or netless copper shapes (teardrops, artwork), in the pictures only: 105 on Top Layer, 60 on Bottom Layer

## Text on the board
Bottom Silkscreen Layer: PE8 | PE5 | 3V3 | VDD | PC1 | PC3 | PA0 | GND | PA4 | PA6 | PC4 | PB0 | PB2 | PA2 | PE7 | PE4 | PE6 | PC0 | PC2 | PA3 | PA5 | PA7 | PC5 | PB1 | PA1 | PE10 | PA9 | PC9 | PC8 | PC15 | PC13 | PD11 | PD15 | PB13 | PB10 | PE14 | PE12 | PD9 | PE9 | PA8 | PC7 | PC6 | PC14 | PC12 | PD10 | PD14 | PB12 | PB11 | PE15 | PE13 | PE11 | PD8 | 5V | PE3 | PE2 | PE1 | PB9 | PE0 | PB7 | PB8 | PB5 | PB6 | PB3 | PB4 | PD6 | PD7 | PD5 | PD4 | PD3 | PD2 | PD1 | PD0 | PC11 | PC10 | PA15
Top Silkscreen Layer: BOOT0 | SW烧录 | 电源 | 复位
